# Altium project ExpansorIO-Leds.PrjPcb
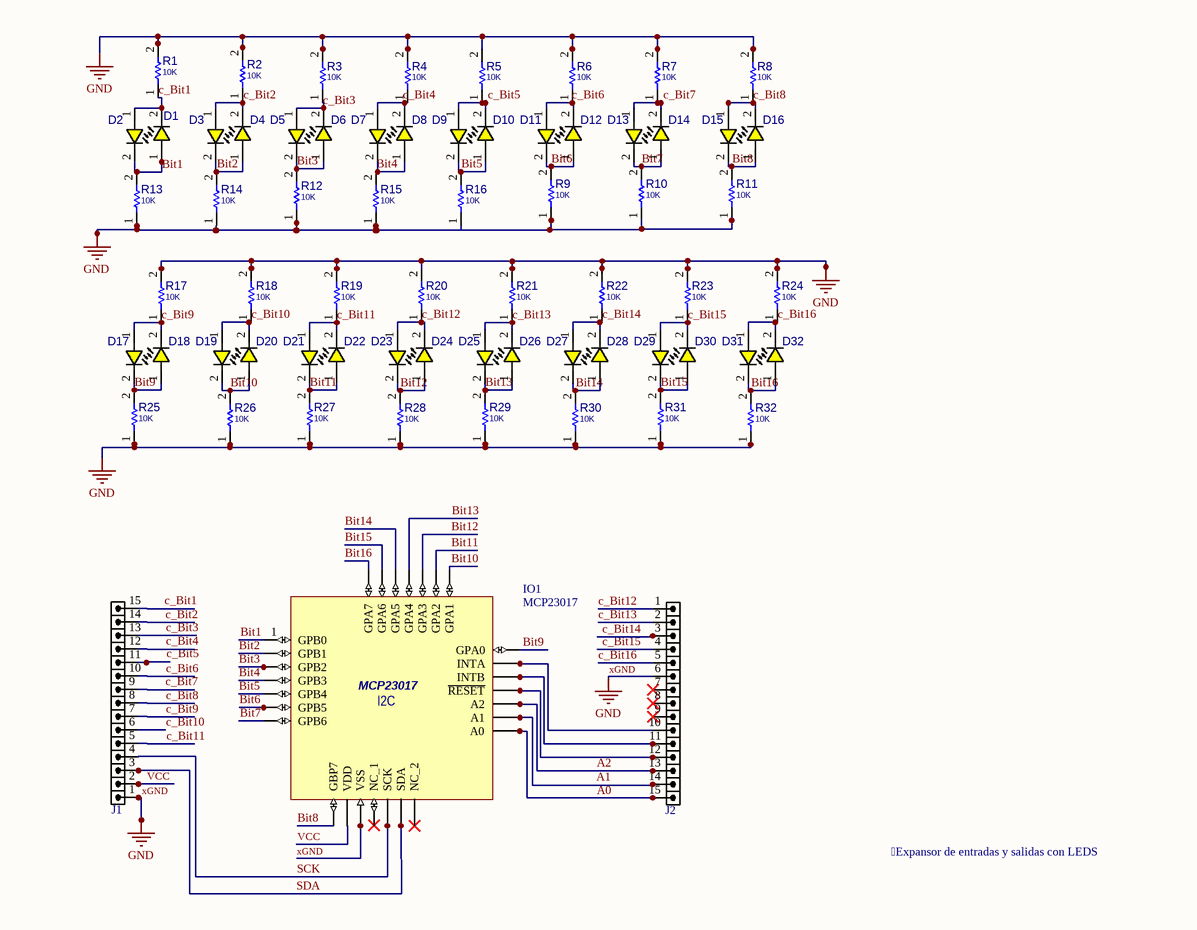
[diagram p0: Esquematico.SchDoc, right]
1 sheet, 67 parts. Net scope: global (net labels, ports and power ports of the same name join across sheets).
Board file: PCB Modulo mcp23017.PcbDoc

## Sheet Esquematico.SchDoc
size A; SheetNumber: 1; SheetTotal: 1

### Parts
D1  LED402YLW  [LED0402YLW]  (value not drawn)
D2  LED402YLW  [LED0402YLW]  (value not drawn)
D3  LED402YLW  [LED0402YLW]  (value not drawn)
D4  LED402YLW  [LED0402YLW]  (value not drawn)
D5  LED402YLW  [LED0402YLW]  (value not drawn)
D6  LED402YLW  [LED0402YLW]  (value not drawn)
D7  LED402YLW  [LED0402YLW]  (value not drawn)
D8  LED402YLW  [LED0402YLW]  (value not drawn)
D9  LED402YLW  [LED0402YLW]  (value not drawn)
D10  LED402YLW  [LED0402YLW]  (value not drawn)
D11  LED402YLW  [LED0402YLW]  (value not drawn)
D12  LED402YLW  [LED0402YLW]  (value not drawn)
D13  LED402YLW  [LED0402YLW]  (value not drawn)
D14  LED402YLW  [LED0402YLW]  (value not drawn)
D15  LED402YLW  [LED0402YLW]  (value not drawn)
D16  LED402YLW  [LED0402YLW]  (value not drawn)
D17  LED402YLW  [LED0402YLW]  (value not drawn)
D18  LED402YLW  [LED0402YLW]  (value not drawn)
D19  LED402YLW  [LED0402YLW]  (value not drawn)
D20  LED402YLW  [LED0402YLW]  (value not drawn)
D21  LED402YLW  [LED0402YLW]  (value not drawn)
D22  LED402YLW  [LED0402YLW]  (value not drawn)
D23  LED402YLW  [LED0402YLW]  (value not drawn)
D24  LED402YLW  [LED0402YLW]  (value not drawn)
D25  LED402YLW  [LED0402YLW]  (value not drawn)
D26  LED402YLW  [LED0402YLW]  (value not drawn)
D27  LED402YLW  [LED0402YLW]  (value not drawn)
D28  LED402YLW  [LED0402YLW]  (value not drawn)
D29  LED402YLW  [LED0402YLW]  (value not drawn)
D30  LED402YLW  [LED0402YLW]  (value not drawn)
D31  LED402YLW  [LED0402YLW]  (value not drawn)
D32  LED402YLW  [LED0402YLW]  (value not drawn)
IO1  MCP23017  [MCP23017-SOIC]
J1  HDR1X15  [HDR_M_1X15]  (value not drawn)
J2  HDR1X15  [HDR_M_1X15]  (value not drawn)
R1  10K  [R0402]
R2  10K  [R0402]
R3  10K  [R0402]
R4  10K  [R0402]
R5  10K  [R0402]
R6  10K  [R0402]
R7  10K  [R0402]
R8  10K  [R0402]
R9  10K  [R0402]
R10  10K  [R0402]
R11  10K  [R0402]
R12  10K  [R0402]
R13  10K  [R0402]
R14  10K  [R0402]
R15  10K  [R0402]
R16  10K  [R0402]
R17  10K  [R0402]
R18  10K  [R0402]
R19  10K  [R0402]
R20  10K  [R0402]
R21  10K  [R0402]
R22  10K  [R0402]
R23  10K  [R0402]
R24  10K  [R0402]
R25  10K  [R0402]
R26  10K  [R0402]
R27  10K  [R0402]
R28  10K  [R0402]
R29  10K  [R0402]
R30  10K  [R0402]
R31  10K  [R0402]
R32  10K  [R0402]

### Nets
xGND: IO1.10(VSS) J1.1 J2.6 R1.2 R2.2 R3.2 R4.2 R5.2 R6.2 R7.2 R8.2 R9.1 R10.1 R11.1 R12.1 R13.1 R14.1 R15.1 R16.1 R17.2 R18.2 R19.2 R20.2 R21.2 R22.2 R23.2 R24.2 R25.1 R26.1 R27.1 R28.1 R29.1 R30.1 R31.1 R32.1  [also labelled GND]
A0: IO1.15(A0) J2.15
A1: IO1.16(A1) J2.14
A2: IO1.17(A2) J2.13
Bit1: D1.1(ANODE) D2.2(CATHODE) IO1.1(GPB0) R13.2
Bit2: D3.2(CATHODE) D4.1(ANODE) IO1.2(GPB1) R14.2
Bit3: D5.2(CATHODE) D6.1(ANODE) IO1.3(GPB2) R12.2
Bit4: D7.2(CATHODE) D8.1(ANODE) IO1.4(GPB3) R15.2
Bit5: D9.2(CATHODE) D10.1(ANODE) IO1.5(GPB4) R16.2
Bit6: D11.2(CATHODE) D12.1(ANODE) IO1.6(GPB5) R9.2
Bit7: D13.2(CATHODE) D14.1(ANODE) IO1.7(GPB6) R10.2
Bit8: D15.2(CATHODE) D16.1(ANODE) IO1.8(GBP7) R11.2
Bit9: D17.2(CATHODE) D18.1(ANODE) IO1.21(GPA0) R25.2
Bit10: D19.2(CATHODE) D20.1(ANODE) IO1.22(GPA1) R26.2
Bit11: D21.2(CATHODE) D22.1(ANODE) IO1.23(GPA2) R27.2
Bit12: D23.2(CATHODE) D24.1(ANODE) IO1.24(GPA3) R28.2
Bit13: D25.2(CATHODE) D26.1(ANODE) IO1.25(GPA4) R29.2
Bit14: D27.2(CATHODE) D28.1(ANODE) IO1.26(GPA5) R30.2
Bit15: D29.2(CATHODE) D30.1(ANODE) IO1.27(GPA6) R31.2
Bit16: D31.2(CATHODE) D32.1(ANODE) IO1.28(GPA7) R32.2
c_Bit1: D1.2(CATHODE) D2.1(ANODE) J1.15 R1.1
c_Bit2: D3.1(ANODE) D4.2(CATHODE) J1.14 R2.1
c_Bit3: D5.1(ANODE) D6.2(CATHODE) J1.13 R3.1
c_Bit4: D7.1(ANODE) D8.2(CATHODE) J1.12 R4.1
c_Bit5: D9.1(ANODE) D10.2(CATHODE) J1.11 R5.1
c_Bit6: D11.1(ANODE) D12.2(CATHODE) J1.10 R6.1
c_Bit7: D13.1(ANODE) D14.2(CATHODE) J1.9 R7.1
c_Bit8: D15.1(ANODE) D16.2(CATHODE) J1.8 R8.1
c_Bit9: D17.1(ANODE) D18.2(CATHODE) J1.7 R17.1
c_Bit10: D19.1(ANODE) D20.2(CATHODE) J1.6 R18.1
c_Bit11: D21.1(ANODE) D22.2(CATHODE) J1.5 R19.1
c_Bit12: D23.1(ANODE) D24.2(CATHODE) J2.1 R20.1
c_Bit13: D25.1(ANODE) D26.2(CATHODE) J2.2 R21.1
c_Bit14: D27.1(ANODE) D28.2(CATHODE) J2.3 R22.1
c_Bit15: D29.1(ANODE) D30.2(CATHODE) J2.4 R23.1
c_Bit16: D31.1(ANODE) D32.2(CATHODE) J2.5 R24.1
SCK: IO1.12(SCK) J1.4
SDA: IO1.13(SDA) J1.3
VCC: IO1.9(VDD) J1.2
NetIO1_18: IO1.18(~{RESET}) J2.12
NetIO1_19: IO1.19(INTB) J2.11
NetIO1_20: IO1.20(INTA) J2.10

Not connected (* = marked no-connect by the designer): IO1 11(NC_1) 14(NC_2)*; J2 7* 8* 9*

### Notes on the sheet
- Expansor de entradas y salidas con LEDS
- (in symbol MCP23017) I2C

### Library data of the parts
D1-D32 = LED_SMD_0402_YLW: LED, SMD, 0402, YELLOW; MANF: Wurth Electronics; DESC: DESCRIPTION; MANF_P#: 150040VS73240, 150040YS73240, HSMY-C280, VAOL-S4GT4; PARAM2: 2.2V; ASSEMBLY: ASSEMBLY; PRICE: 0.3$; VALUE: LED402YLW
IO1 = MCP23017: 16-Bit I/O Expander with Serial Interface; ComponentLink1Description: link; ComponentLink1URL: https://ww1.microchip.com/downloads/en/devicedoc/20001952c.pdf
J1 J2 = Header Male THT 1x15: CONN, HEADER, Male, pitch: 2.54mm, 15POS; VALUE: HDRM15
R1-R32 = RES_SMD: RESISTOR, SMD; PARAM: 0.063W; DESC: DESCRIPTION; DIST#: MOUSER; PARAM2: 1%; MANF_P#: -; MANF: -; ASSEMBLY: ASSEMBLY; PRICE: 100= 0.5$; VALUE: 10K